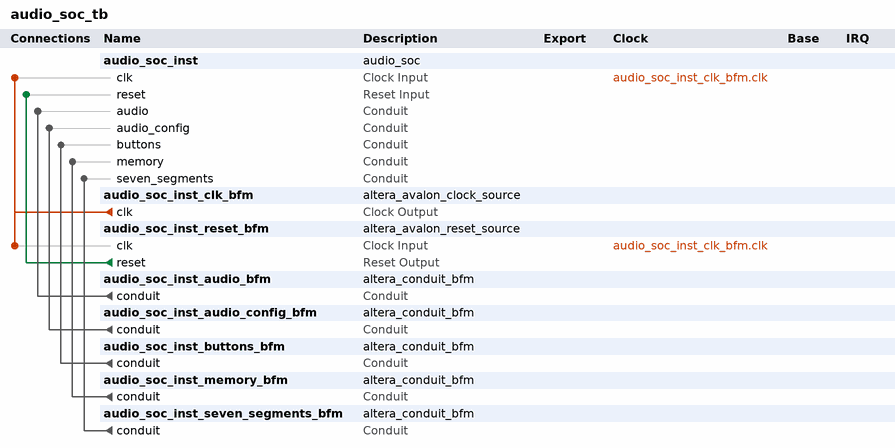
[diagram p0: system contents]
# Platform Designer (Qsys) system audio_soc_tb, Cyclone V 5CSEMA5F31C6
# Parameters at their usual value, and those the tool derives, are not listed.
package require -exact qsys 18.1
create_system audio_soc_tb
set_project_property DEVICE_FAMILY {Cyclone V}
set_project_property DEVICE 5CSEMA5F31C6

add_instance audio_soc_inst audio_soc 1.0

add_instance audio_soc_inst_clk_bfm altera_avalon_clock_source 18.1

add_instance audio_soc_inst_reset_bfm altera_avalon_reset_source 18.1
set_instance_parameter_value audio_soc_inst_reset_bfm ASSERT_HIGH_RESET 0
set_instance_parameter_value audio_soc_inst_reset_bfm INITIAL_RESET_CYCLES 50

add_instance audio_soc_inst_audio_bfm altera_conduit_bfm 18.1
set_instance_parameter_value audio_soc_inst_audio_bfm CLOCKED_SIGNAL false
set_instance_parameter_value audio_soc_inst_audio_bfm ENABLE_RESET false
set_instance_parameter_value audio_soc_inst_audio_bfm SIGNAL_DIRECTIONS output,input,output
set_instance_parameter_value audio_soc_inst_audio_bfm SIGNAL_ROLES BCLK,DACDAT,DACLRCK
set_instance_parameter_value audio_soc_inst_audio_bfm SIGNAL_WIDTHS 1,1,1

add_instance audio_soc_inst_audio_config_bfm altera_conduit_bfm 18.1
set_instance_parameter_value audio_soc_inst_audio_config_bfm CLOCKED_SIGNAL false
set_instance_parameter_value audio_soc_inst_audio_config_bfm ENABLE_RESET false
set_instance_parameter_value audio_soc_inst_audio_config_bfm SIGNAL_DIRECTIONS input,bidir
set_instance_parameter_value audio_soc_inst_audio_config_bfm SIGNAL_ROLES SCLK,SDAT
set_instance_parameter_value audio_soc_inst_audio_config_bfm SIGNAL_WIDTHS 1,1

add_instance audio_soc_inst_buttons_bfm altera_conduit_bfm 18.1
set_instance_parameter_value audio_soc_inst_buttons_bfm CLOCKED_SIGNAL false
set_instance_parameter_value audio_soc_inst_buttons_bfm ENABLE_RESET false
set_instance_parameter_value audio_soc_inst_buttons_bfm SIGNAL_DIRECTIONS output
set_instance_parameter_value audio_soc_inst_buttons_bfm SIGNAL_WIDTHS 1

add_instance audio_soc_inst_memory_bfm altera_conduit_bfm 18.1
set_instance_parameter_value audio_soc_inst_memory_bfm CLOCKED_SIGNAL false
set_instance_parameter_value audio_soc_inst_memory_bfm ENABLE_RESET false
set_instance_parameter_value audio_soc_inst_memory_bfm SIGNAL_DIRECTIONS input,input,input,input,input,input,input,input,bidir,bidir,bidir,input,input,input,input,output
set_instance_parameter_value audio_soc_inst_memory_bfm SIGNAL_ROLES mem_a,mem_ba,mem_cas_n,mem_ck,mem_ck_n,mem_cke,mem_cs_n,mem_dm,mem_dq,mem_dqs,mem_dqs_n,mem_odt,mem_ras_n,mem_reset_n,mem_we_n,oct_rzqin
set_instance_parameter_value audio_soc_inst_memory_bfm SIGNAL_WIDTHS 13,3,1,1,1,1,1,1,8,1,1,1,1,1,1,1

add_instance audio_soc_inst_seven_segments_bfm altera_conduit_bfm 18.1
set_instance_parameter_value audio_soc_inst_seven_segments_bfm CLOCKED_SIGNAL false
set_instance_parameter_value audio_soc_inst_seven_segments_bfm ENABLE_RESET false
set_instance_parameter_value audio_soc_inst_seven_segments_bfm SIGNAL_DIRECTIONS input
set_instance_parameter_value audio_soc_inst_seven_segments_bfm SIGNAL_WIDTHS 28

# connections
add_connection audio_soc_inst_clk_bfm.clk audio_soc_inst.clk clock
add_connection audio_soc_inst_clk_bfm.clk audio_soc_inst_reset_bfm.clk clock
add_connection audio_soc_inst_reset_bfm.reset audio_soc_inst.reset reset
add_connection audio_soc_inst_audio_bfm.conduit audio_soc_inst.audio conduit
add_connection audio_soc_inst_audio_config_bfm.conduit audio_soc_inst.audio_config conduit
add_connection audio_soc_inst_buttons_bfm.conduit audio_soc_inst.buttons conduit
add_connection audio_soc_inst_memory_bfm.conduit audio_soc_inst.memory conduit
add_connection audio_soc_inst_seven_segments_bfm.conduit audio_soc_inst.seven_segments conduit

set_interconnect_requirement {$system} qsys_mm.clockCrossingAdapter HANDSHAKE
set_interconnect_requirement {$system} qsys_mm.enableEccProtection FALSE
set_interconnect_requirement {$system} qsys_mm.insertDefaultSlave FALSE
set_interconnect_requirement {$system} qsys_mm.maxAdditionalLatency 1

save_system audio_soc_tb.qsys
